# Altium schematic sheet Connectors.SchDoc: Connectors
size A4; Author: Joao Guimaraes; Organization: Altium Limited; Address1: L3, 12a Rodborough Rd; Address2: Frenchs Forest; Address3: NSW; Address4: Australia 2086; Revision: 1.0.0
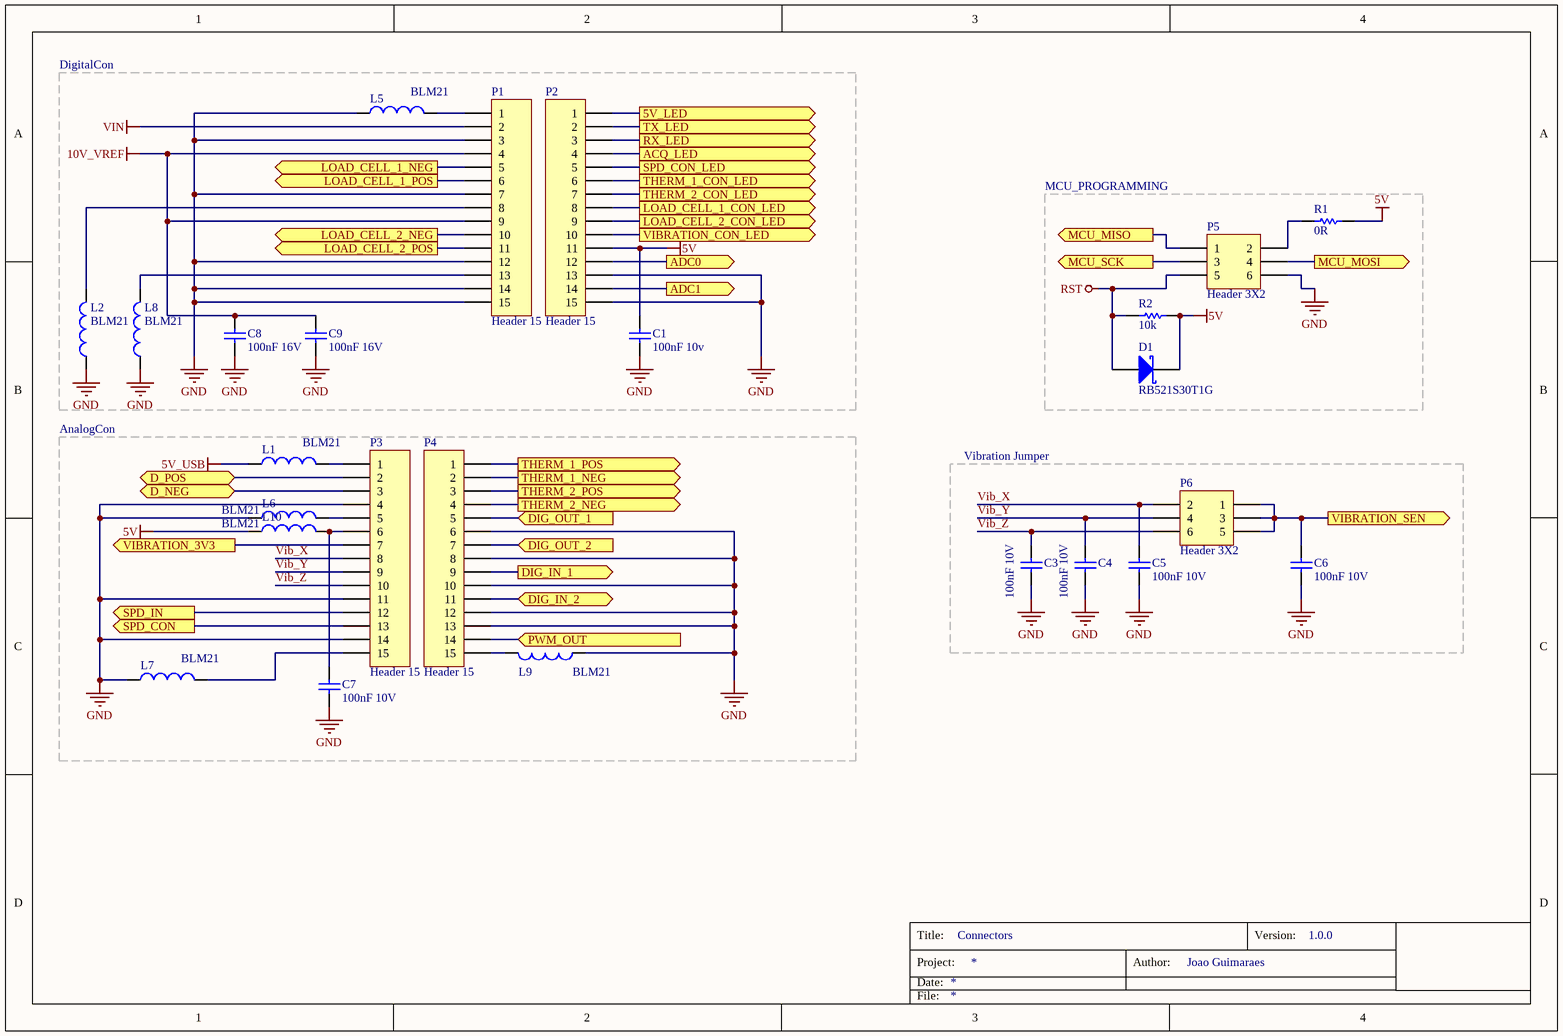
[diagram p0: Connectors.SchDoc]

## Parts
C1  100nF 10v  [C0805]
C3  100nF 10V  [C0805]
C4  100nF 10V  [C0805]
C5  100nF 10V  [C0805]
C6  100nF 10V  [C0805]
C7  100nF 10V  [C0805]
C8  100nF 16V  [C0805]
C9  100nF 16V  [C0805]
D1  RB521S30T1G  [SOD-523]
L1  BLM21  [6-0805_M]
L2  BLM21  [6-0805_M]
L5  BLM21  [6-0805_M]
L6  BLM21  [6-0805_M]
L7  BLM21  [6-0805_M]
L8  BLM21  [6-0805_M]
L9  BLM21  [6-0805_M]
L10  BLM21  [6-0805_M]
P1  Header 15  [HDR1X15]
P2  Header 15  [HDR1X15]
P3  Header 15  [HDR1X15]
P4  Header 15  [HDR1X15]
P5  Header 3X2  [HDR2X3]
P6  Header 3X2  [HDR2X3]
R1  0R  [6-0805_M]
R2  10k  [6-0805_M]

## Blocks framed on the sheet
DigitalCon: C1 C8 C9 L2 L5 L8 P1 P2
MCU_PROGRAMMING: D1 P5 R1 R2
AnalogCon: C7 L1 L6 L7 L9 L10 P3 P4
Vibration Jumper: C3-C6 P6

## Ports
5V_LED (out), ACQ_LED (out), ADC0 (out), ADC1 (out), D_NEG, D_POS, DIG_IN_1 (out), DIG_IN_2, DIG_OUT_1 (in), DIG_OUT_2 (in), LOAD_CELL_1_CON_LED (out), LOAD_CELL_1_NEG (out), LOAD_CELL_1_POS (out), LOAD_CELL_2_CON_LED (out), LOAD_CELL_2_NEG (out), LOAD_CELL_2_POS (out), MCU_MISO (out), MCU_MOSI (out), MCU_SCK (out), PWM_OUT (in), RX_LED (out), SPD_CON (out), SPD_CON_LED (out), SPD_IN (out), THERM_1_CON_LED (out), THERM_1_NEG (out), THERM_1_POS (out), THERM_2_CON_LED (out), THERM_2_NEG (out), THERM_2_POS (out), TX_LED (out), VIBRATION_3V3 (out), VIBRATION_CON_LED (out), VIBRATION_SEN (out)

## Nets
5V: C1.2 D1.2(K) L10.1 P2.11 R1.2 R2.2
5V_USB: L1.1
10V_VREF: C8.2 C9.2 P1.4 P1.9
GND: C1.1 C3.1 C4.1 C5.1 C6.1 C7.1 C8.1 C9.1 L2.1 L5.1 L6.1 L7.1 L8.1 L9.1 P1.3 P1.7 P1.12 P1.14 P1.15 P2.13 P2.15 P3.4 P3.11 P3.14 P4.6 P4.8 P4.10 P4.12 P4.13 P5.6
RST: D1.1(A) P5.5 R2.1
VIN: P1.2
5V_LED: P2.1 ; port 5V_LED
ACQ_LED: P2.4 ; port ACQ_LED
ADC0: P2.12 ; port ADC0
ADC1: P2.14 ; port ADC1
D_NEG: P3.3 ; port D_NEG
D_POS: P3.2 ; port D_POS
DIG_IN_1: P4.9 ; port DIG_IN_1
DIG_IN_2: P4.11 ; port DIG_IN_2
DIG_OUT_1: P4.5 ; port DIG_OUT_1
DIG_OUT_2: P4.7 ; port DIG_OUT_2
LOAD_CELL_1_CON_LED: P2.8 ; port LOAD_CELL_1_CON_LED
LOAD_CELL_1_NEG: P1.5 ; port LOAD_CELL_1_NEG
LOAD_CELL_1_POS: P1.6 ; port LOAD_CELL_1_POS
LOAD_CELL_2_CON_LED: P2.9 ; port LOAD_CELL_2_CON_LED
LOAD_CELL_2_NEG: P1.10 ; port LOAD_CELL_2_NEG
LOAD_CELL_2_POS: P1.11 ; port LOAD_CELL_2_POS
MCU_MISO: P5.1 ; port MCU_MISO
MCU_MOSI: P5.4 ; port MCU_MOSI
MCU_SCK: P5.3 ; port MCU_SCK
PWM_OUT: P4.14 ; port PWM_OUT
RX_LED: P2.3 ; port RX_LED
SPD_CON: P3.13 ; port SPD_CON
SPD_CON_LED: P2.5 ; port SPD_CON_LED
SPD_IN: P3.12 ; port SPD_IN
THERM_1_CON_LED: P2.6 ; port THERM_1_CON_LED
THERM_1_NEG: P4.2 ; port THERM_1_NEG
THERM_1_POS: P4.1 ; port THERM_1_POS
THERM_2_CON_LED: P2.7 ; port THERM_2_CON_LED
THERM_2_NEG: P4.4 ; port THERM_2_NEG
THERM_2_POS: P4.3 ; port THERM_2_POS
TX_LED: P2.2 ; port TX_LED
Vib_X: C5.2 P3.8 P6.2
Vib_Y: C4.2 P3.9 P6.4
Vib_Z: C3.2 P3.10 P6.6
VIBRATION_3V3: P3.7 ; port VIBRATION_3V3
VIBRATION_CON_LED: P2.10 ; port VIBRATION_CON_LED
VIBRATION_SEN: C6.2 P6.1 P6.3 P6.5 ; port VIBRATION_SEN
NetC7_2: C7.2 L10.2 P3.6
NetL1_2: L1.2 P3.1
NetL2_2: L2.2 P1.8
NetL5_2: L5.2 P1.1
NetL6_2: L6.2 P3.5
NetL7_2: L7.2 P3.15
NetL8_2: L8.2 P1.13
NetL9_2: L9.2 P4.15
NetP5_2: P5.2 R1.1

## Notes on the sheet
- Title:
- Project:
- Date:
- Author:
- Version:
- File:

## Library data of the parts
C1 C3-C9 = Cap: Capacitor; PartNumber: CAP.100n.10V.20%.SMD.0402; Manufacturer: Wurth; ClassName: MCU; Price: 0.015; Supplier: Mouser
D1 = RB521S30T1G: Schottky Diodes & Rectifiers 30V 200mW Single; pin to pad: 1>2 2>1; Manufacturer: ON Semiconductor; ClassName: Connectors; PartNumber: RB521S30T1G; Price: 0.18; Supplier: Mouser
L1 L2 L5-L10 = Inductor: Chip Inductor; Manufacturer: Murata Electronics; ClassName: Connectors; PartNumber: BLM21; Price: 0.19; Supplier: Mouser
P1-P4 = Header 15: Header, 15-Pin
P5 P6 = Header 3X2: Header, 3-Pin, Dual row; ClassName: Connectors; PartNumber: Header 3X2; Price: 1.00; Supplier: ContatoPro
R1 = Res: Resistor; PartNumber: RES.0R.1/8W.5%.SMD.0805; Manufacturer: Vishay; ClassName: TemperatureACQ; Price: 0.044; Supplier: Mouser
R2 = Res: Resistor; PartNumber: RES.10K.1/8W.5%.SMD.0805; Manufacturer: Yageo; ClassName: Connectors; Price: 0.012; Supplier: Mouser